# EAGLE design caps-lock-buzzer (EAGLE 7.7.0)
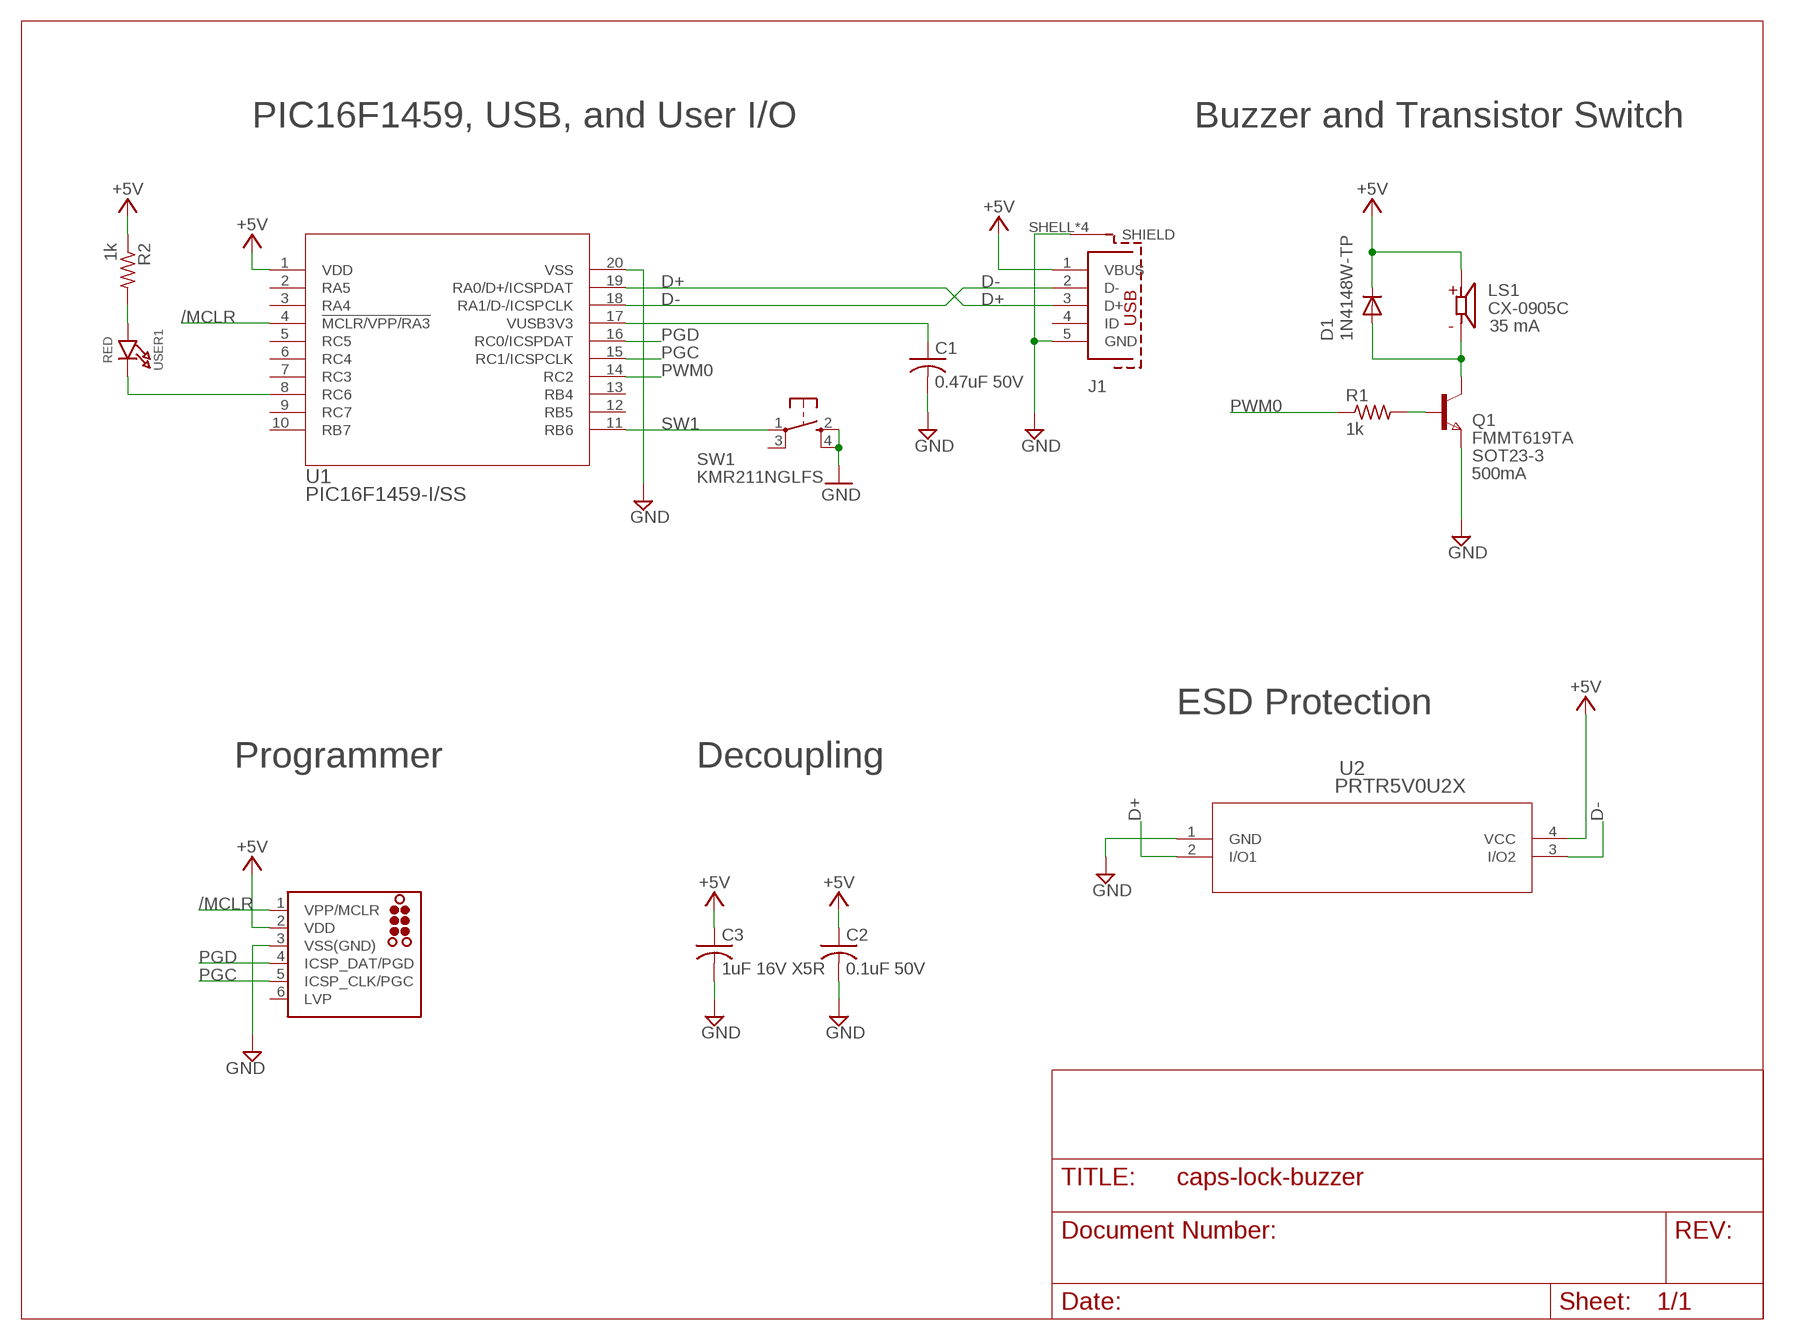
[diagram p0: schematic, sheet 1]

## Parts
C1  0.47uF 50V  C-USC1206K  [C1206K]
C2  0.1uF 50V  C-USC1206K  [C1206K]
C3  1uF 16V X5R  C-USC1210  [C1210]
D1  1N4148W-TP  DIODE-SOD123  [SOD123]
J1  629105136821  [629105136821]
J3  TC2030-MCP-NL  [TC2030-MCP-NL]
LS1  CX-0905C  [CUI_CX-0905C]
Q1  FMMT619TA  NPNSOT23  [SOT-23]
R1  1k  R-US_R0805  [R0805]
R2  1k  R-US_R0805  [R0805]
SW1  KMR211NGLFS  SPST_TACT-KMR2  [KMR2]
U1  PIC16F1459-I/SS  [SSOP20_MC]
U2  PRTR5V0U2X  [SOT143B]
USER1  RED  LED0805_NOOUTLINE  [CHIPLED_0805_NOOUTLINE]

## Nets
+5V: C2.1 C3.1 D1.C J1.1(VBUS) J3.2(VDD) LS1.P R2.1 U1.1(VDD) U2.4(VCC)
/MCLR: J3.1(VPP/MCLR) U1.4(!MCLR/VPP/RA3)
D+: J1.3(D+) U1.19(RA0/D+/ICSPDAT) U2.2(I/O1)
D-: J1.2(D-) U1.18(RA1/D-/ICSPCLK) U2.3(I/O2)
GND: C1.2 C2.2 C3.2 J1.5(GND) J1.SHELL1(SHIELD) J1.SHELL2(SHIELD) J1.SHELL3(SHIELD) J1.SHELL(SHIELD) J3.3(VSS(GND)) Q1.2(E) SW1.2(S) SW1.4(S1) U1.20(VSS) U2.1(GND)
N$2: R2.2 USER1.A
N$3: U1.8(RC6) USER1.C
N$16: Q1.3(B) R1.2
OUT0: D1.A LS1.N Q1.1(C)
PGC: J3.5(ICSP_CLK/PGC) U1.15(RC1/ICSPCLK)
PGD: J3.4(ICSP_DAT/PGD) U1.16(RC0/ICSPDAT)
PWM0: R1.1 U1.14(RC2)
SW1: SW1.1(P) U1.11(RB6)
VUSB: C1.1 U1.17(VUSB3V3)
Unconnected: J1.4(ID) J3.6(LVP) SW1.3(P1) U1.2(RA5) U1.3(RA4) U1.5(RC5) U1.6(RC4) U1.7(RC3) U1.9(RC7) U1.10(RB7) U1.12(RB5) U1.13(RB4)

## Notes on the sheet
- PIC16F1459, USB, and User I/O | Buzzer and Transistor Switch
- 35 mA
- SOT23-3
- 500mA
- ESD Protection
- Programmer | Decoupling

## Library data of the parts
C1 = rcl:C-US: CAPACITOR, American symbol; MFR: KEMET; MFR_PART_NO: C1206C474K5RACTU
C2 = rcl:C-US: CAPACITOR, American symbol; MFR: KEMET; MFR_PART_NO: C1206S104M5RACTU
C3 = rcl:C-US: CAPACITOR, American symbol; MFR: KEMET; MFR_PART_NO: C1210C105K4PACTU
D1 = diode:DIODE-: DIODE
J1 = InputOutputIO (rev18a):629105136821: WR-COM SMT Horizontal 5 Contacts Micro USB Type B,5 pins=>Code : Con_I-O_COM_MicroUSB_629105136821 <http://katalog.we-online.de/media/images/eican/Con_I-O_COM_MicroUSB_629105136821_pf2.jpg> Details see: http://katalog.we-online.de/en/em/COM_MICRO_SMT_TYPE_B_HORIZONTAL/629105136821?m Created 2014-07-09, Karrer Zheng 2014 (C) Würth Elektronik
J3 = tag-connect:TC2030: TAG-CONNECT ICSP Connector Manufacturer: Tag-Connect <http://www.tag-connect.com> Cable for easy In-Circuit Serial Programming. Designed for Microchip ICD2, suitable for many others. Two variants - one "with legs" (for hands-free fit on PCB) and another "without legs" for quick programming. PAD Description 1 MCLR/Vpp 2 Vdd 3 GND 4 PGD (ISPDAT) 5 PGC (ISPCLK) 6 nc (used for LVP) ©2009 ROFA.cz - modified and updated by Robert Darlington ‹rdarlington@gmail.com›
LS1 = CX-0905C:CX-0905C: 9.6 mm, 5 V, 80 dB, 2.7 kHz, Through Hole, Sealed, Driving Circuit, Magnetic Audio Indicator Buzzer; AVAILABILITY: Good; DESCRIPTION: 9.6 mm, 5 V, 80 dB, 2.7 kHz, Through Hole, Sealed, Driving Circuit, Magnetic Audio Indicator Buzzer; MF: CUI; MP: CX-0905C; PACKAGE: CUI; PRICE: 1.32 USD
Q1 = zetex:NPNSOT23: NPN TRANSISTOR; MPN: DSS20201L-7; OC_FARNELL: 1710688; OC_NEWARK: 25R4555
R1 R2 = rcl:R-US_: RESISTOR, American symbol
SW1 = adafruit:SPST_TACT: SMT 6mm switch, EVQQ2 series http://www.ladyada.net/library/eagle
U1 = pic16f1459-i-ss:PIC16F1459-I/SS; MANUFACTURER_PART_NUMBER: PIC16F1459ISS; VENDOR: Microchip
U2 = Nexperia_PRTR5V0U2X,215:PRTR5V0U2X; MANUFACTURER_PART_NUMBER: PRTR5V0U2X; VENDOR: NXP
USER1 = microbuilder:LED: LED 0603 - 0603 Surface Mount Package 2mA: Green LED - Low Power (3.9mcd, 2ma, 1.7Vf) - Digikey: 475-2709-2-ND Orange LED - Low Power (9.8mcd, 2ma, 1.8Vf) - Digikey: 475-1194-2-ND Red LED - Low Power (5mcd, 2ma, 1.8Vf) - Digikey: 475-1195-2-ND Yellow LED - Low Power (7mcd, 2ma, 1.8Vf) - Digikey: 475-1196-2-ND 5mA: Blue LED - Low Power (17mcd, 5ma, 2.9Vf) - Digikey: LNJ937W8CRACT-ND 0805 - 0805 Surface Mount Package 2mA: Red LED (8.8mcd, 2mA, 1.8Vf, Clear) - Low Power [Digikey: 475-2510-1-ND] Green LED (5mcd, 2mA, 1.8Vf, Clear) - Low Power [Digikey: 475-2730-1-ND] Yellow LED (11.3mcd, 2mA, 1.8Vf, Clear) - Low Power [Digikey: 475-2555-1-ND] 20mA: Red LED (104mcd, 20mA, Diffused) - LS R976 [Digikey: 475-1278-6-ND] Red LED (12mcd, 20mA, 2.0Vf, Clear) - APT2012EC [Digikey: 754-1128-1-ND] Green LED (15mcd, 20mA, 2.2Vf, Clear) - APT2012GC [Digikey: 754-1131-1-ND] Orange LED (160mcd, 20mA, 2.1Vf, Clear) - APT2012SECK [Digikey: 754-1130-1-ND] 1206 - 1206 Surface Mount Package Green LED (26mcd, 20mA, Diffused) - LG N971 [Digikey: 475-1407-6-ND] Red LED (15mcd, 20mA, Diffused) - LH N974 [Digikey: 475-1416-6-ND] Cree - Cree High-Power Surface Mount LEDs XPEBWT-L1-0000-00D50 - White 111lm 350mA 2.9Vf 6200K 110° XTEAWT-00-0000-00000LEE3 - White 114lm 350mA 2.85Vf 5000K 115° Everlight - Everlight 45-21 Series Surface Mount LEDs 45-21/QK2C-B2832AC2CB2/2T - Warm White 2000mcd 20mA 3.25Vf 3050K 120° 45-21/LK2C-B38452C4CB2/2T - Nuetral White 2000mcd 20mA 3.25Vf 4150K 120° 45-21/LK2C-B50634C6CB2/2T - Cold White 2200mcd 20mA 3.25Vf 5650K 120° PLCC2 Reverse Mount LS T77K-J1L2-1-0-2-R18-Z - Red 11.25mcd 2mA 1.8Vf 630nm 120° LO T77K-L1M2-24-Z - Orange 19.6mcd 2mA 1.8Vf 606nm 120° LY T77K-K2M1-26-Z - Yellow 15.7mcd 2mA 1.8Vf 587nm 120°

## Board
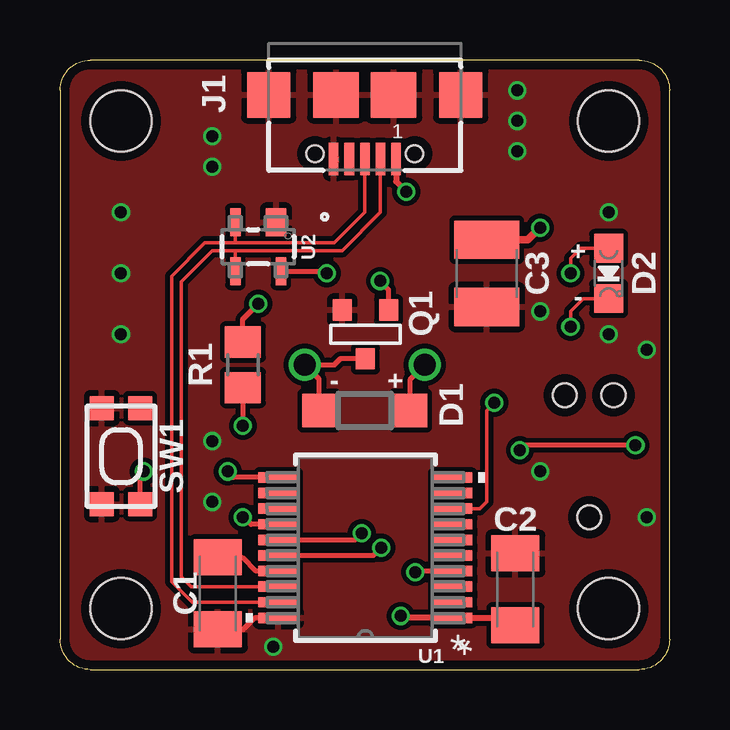
[diagram p1: board, top side]
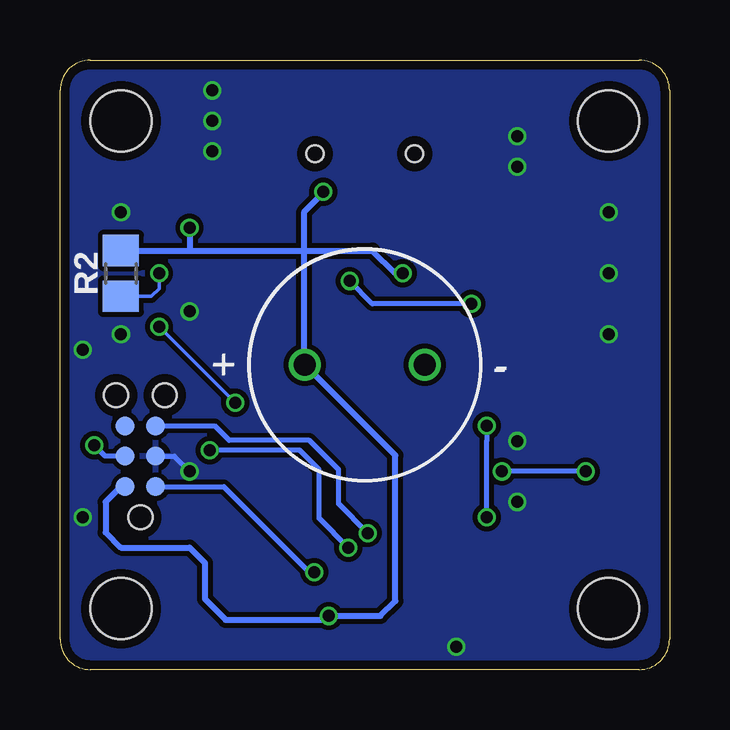
[diagram p2: board, bottom side, seen from below]

Size 25.4 x 25.4 mm. Coordinates in mm from the lower left corner, seen from the top.
Outline: 1.27,0 24.13,0 arc90 25.4,1.27 25.4,24.13 arc90 24.13,25.4 1.27,25.4 arc90 0,24.13 0,1.27 arc90 1.27,0
Copper layers (1*16): Top 0.035559375mm / dielectric 1.6mm / Bottom 0.035559375mm
Design rules "oshpark-2layer-2018": minimum track width 6mil, minimum drill 10mil, track to track 6mil, track to pad 6mil, pad to pad 6mil, via to via 6mil, smd to smd 6mil, copper to edge 15mil, drill to drill 6mil, minimum pad ring 5mil, minimum via ring 5mil, stop-mask expansion 2.5mil, vias tented up to drill 0mil, thermal gap 10mil
Holes 2.54 mm at 2.54,2.54 2.54,22.86 22.86,22.86 22.86,2.54
tKeepout: area 0,0 to 4.5,4.5; area 20.9,0 to 25.4,4.5; area 20.9,20.9 to 25.4,25.4; area 0,20.9 to 4.5,25.4
bKeepout: area 0,20.3 to 5.1,25.4; area 20.3,20.3 to 25.4,25.4; area 20.3,0 to 25.4,5.1; area 0,0 to 5.1,5.1

### Footprints (pad centres in the part's own frame; a part is rotated, then mirrored left to right if it is on the bottom)
C1206K = smd 1.5 x 2: 1 -1.5,0; 2 1.5,0
C1210 = smd 1.6 x 2.7: 1 -1.4,0; 2 1.4,0
SOD123 = smd 1.4 x 1.4: A 1.9,0; C -1.9,0
629105136821 = smd 0.4 x 1.35: 1 -1.3,2.675; 2 -0.65,2.675; 3 0,2.675; 4 0.65,2.675; 5 1.3,2.675 | smd 1.8 x 1.9: SHELL -4,0; SHELL3 4,0 | smd 1.9 x 1.9: SHELL1 -1.2,0; SHELL2 1.2,0 | hole 0.7: -2.075,2.45; 2.075,2.45
TC2030-MCP-NL = smd 0.787 x 0.787: 1 1.27,-0.635; 2 1.27,0.635; 3 2.54,-0.635; 4 2.54,0.635; 5 3.81,-0.635; 6 3.81,0.635 | hole 0.991: 0,0; 5.08,-1.016; 5.08,1.016
CUI_CX-0905C = drill 0.9: N 2.5,0; P -2.5,0
SOT-23 = smd 0.787 x 0.889: 1 0.025,-1.016; 2 -0.94,1.016; 3 0.991,1.016
R0805 = smd 1.3 x 1.5: 1 -0.95,0; 2 0.95,0
KMR2 = smd 1 x 1: 1 2,0.8; 2 2,-0.8; 3 -2,0.8; 4 -2,-0.8
SSOP20_MC = smd 1.651 x 0.432: 1 -3.632,2.925; 2 -3.632,2.275; 3 -3.632,1.625; 4 -3.632,0.975; 5 -3.632,0.325; 6 -3.632,-0.325; 7 -3.632,-0.975; 8 -3.632,-1.625; 9 -3.632,-2.275; 10 -3.632,-2.925; 11 3.632,-2.925; 12 3.632,-2.275; 13 3.632,-1.625; 14 3.632,-0.975; 15 3.632,-0.325; 16 3.632,0.325; 17 3.632,0.975; 18 3.632,1.625; 19 3.632,2.275; 20 3.632,2.925
SOT143B = smd 0.838 x 1.168: 1 -0.747,-1.016 | smd 0.432 x 1.168: 2 0.95,-1.016; 3 0.95,1.016; 4 -0.95,1.016
CHIPLED_0805_NOOUTLINE = smd 1.2 x 1.2: A 0,-1.05; C 0,1.05

### Placement (x,y rotation side)
C1  6.58,3.17 270 top
C2  18.97,3.34 90 top
C3  17.78,16.51 270 top
D1  12.7,10.79 180 top
J1  12.7,23.95 180 top
J3  22.05,6.35 90 bottom
LS1  12.7,12.7 0 bottom
Q1  12.7,13.97 0 top
R1  7.62,12.7 90 top
R2  22.86,16.51 270 bottom
SW1  2.54,8.89 270 top
U1  12.73,5.08 180 top
U2  8.26,17.62 180 top
USER1  22.86,16.51 180 top

### Tracks (layer width: path | path; a pad name or v marks a point on that pad's centre or on a via)
+5V  (via drill 0.5)
  Top 0.203: 18.34,2.15 C2.1 | U2.4 11.02,16.61 v11.11,16.51 | D1.C 14.6,12.1 LS1.P
  Top 0.254: v14.2,2.23 14.28,2.15 U1.1 18.34,2.15 | J1.1 14,20.34 v14.43,19.91
  Top 0.305: C3.1 19.5,17.91 v20,18.41
  Bottom 0.254: 14.43,19.86 15.24,19.05 15.24,17.46 | 15.24,17.46 15.24,12.74 | R2.1 20,17.46 | 20,17.46 15.24,17.46 | v11.11,16.51 11.43,16.51 12.38,17.46 15.24,17.46 | LS1.P 11.43,8.93 11.43,2.86 12.05,2.23 v14.2,2.23 14.36,2.08 18.5,2.08 19.37,2.94 19.37,4.45 20,5.08 22.86,5.08 23.5,5.71 23.5,6.99 22.86,7.62 | v20,18.41 20,17.46
  Bottom 0.305: v14.43,19.91 14.43,19.86 | 15.24,12.74 LS1.P | J3.2 22.86,7.62
/MCLR  (via drill 0.5)
  Top 0.203: U1.4 14.85,4.11 v14.81,4.06
  Bottom 0.203: v14.81,4.06 15.01,4.06 18.57,7.62 J3.1
D+
  Top 0.152: U1.19 5.5,2.81 4.65,3.66 4.65,16.4 6.03,17.78 7.3,17.78 | J1.3 12.7,19.05 11.43,17.78 7.3,17.78 | U2.2 7.3,17.78
D-
  Top 0.152: U1.18 5.46,3.46 5.05,3.86 5.05,16.17 6.35,17.46 7.3,17.46 | J1.2 13.35,19.05 11.76,17.46 7.3,17.46 | U2.3 7.3,17.46
GND  (via drill 0.5)
  Top 0.203: C1.2 7.64,1.68 8.12,2.15 U1.20
  Bottom 0.203: J3.3 20.64,8.89 v20,8.26
  other vias: 2.54,19.05 2.54,16.51 2.54,13.97 6.35,22.23 6.35,20.95 19.05,24.13 19.05,22.86 19.05,21.59 22.86,19.05 22.86,13.97 24.45,13.34 24.45,6.35 8.89,0.95 6.35,9.53 6.35,6.99 20,14.92
  pour Top (isolate 0.203): 0,25.4 25.4,25.4 25.4,0 0,0
  pour Bottom (isolate 0.203): 0,0 25.4,0 25.4,25.4 0,25.4
N$2  (via drill 0.5)
  Top 0.152: USER1.A 21.69,17.56 21.27,17.14 v21.27,16.51
  Bottom 0.152: v21.27,16.51 21.27,15.88 21.59,15.56 R2.2
N$3  (via drill 0.5)
  Top 0.152: U1.8 17.5,6.71 17.78,6.99 17.78,10.79 v18.1,11.11 | USER1.C 21.81,15.46 21.27,14.92 v21.27,14.29
  Bottom 0.152: v18.1,11.11 v21.27,14.29
N$16  (via drill 0.5)
  Top 0.203: R1.2 7.62,14.61 v8.26,15.24 | Q1.3 13.69,15.84 v13.34,16.19
  Bottom 0.203: v8.26,15.24 12.38,15.24 v13.34,16.19
OUT0
  Top 0.203: D1.A 10.8,12.1 LS1.N 11.43,12.7 11.68,12.95 Q1.1
PGC  (via drill 0.5)
  Top 0.203: U1.15 12.29,5.41 v12.57,5.69
  Bottom 0.203: v12.57,5.69 13.79,6.91 13.79,8.33 15.01,9.55 18.35,9.55 18.96,10.16 J3.5
PGD  (via drill 0.5)
  Top 0.203: U1.16 13.06,4.75 v13.39,5.08 | v23.98,9.35 19.37,9.35 v19.16,9.14
  Bottom 0.203: v13.39,5.08 14.61,6.3 14.61,8.33 15.42,9.14 v19.16,9.14 | J3.4 23.52,8.89 v23.98,9.35
PWM0  (via drill 0.5)
  Top 0.203: U1.14 7.96,6.05 v7.62,6.35 | R1.1 v7.62,10.16
  Bottom 0.203: v7.62,6.35 7.62,9.53 v7.62,10.16
SW1  (via drill 0.5)
  Top 0.203: SW1.1 3.34,8.1 v3.49,8.26 | U1.11 7.24,8.01 v6.99,8.26
  Bottom 0.203: v3.49,8.26 v6.99,8.26
VUSB
  Top 0.203: C1.1 7.59,4.67 8.16,4.11 U1.17

### Text on the board
_tsilk: J1 | U2 | C3 | + | D2 | - | Q1 | R1 | - | + | D1 | SW1 | C2 | C1 | U1 | *
_bsilk: R2 | - | +